# Altium schematic sheet top.SchDoc
size 431 x 279 mm; Author: Pawel Bukowiec; Organization: ORGANIZATION; Address1: ADDRESS 1; Address2: ADDRESS 2; Address3: ADDRESS 3; Address4: ADDRESS 4; Revision: 1; SheetNumber: 2; SheetTotal: 5; ENG_APP_DATE: --/--/--; DSN_APP_DATE: --/--/--; CHK_APP_DATE: --/--/--
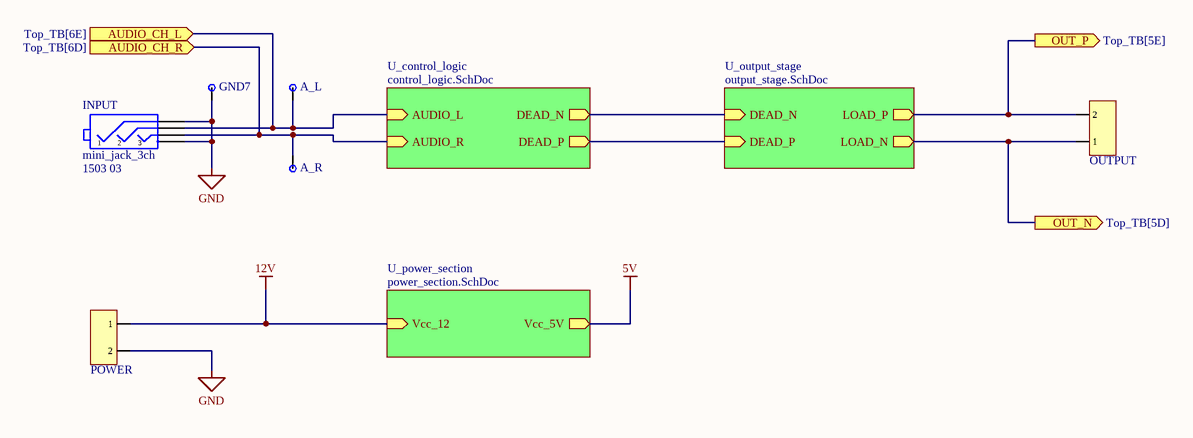
[diagram p0: top.SchDoc]

## Parts
A_L  TestPoint  [TestPoint_SMT]  (value not drawn)
A_R  TestPoint  [TestPoint_SMT]  (value not drawn)
GND7  TestPoint  [TestPoint_SMT]  (value not drawn)
INPUT  mini_jack_3ch  Part number: 1503 03  [150303_mini_jack3.5mm]  (graphical)
OUTPUT  Connector_1x2  [TerminalBlock_1x2]  (value not drawn)  (graphical)
POWER  Connector_1x2  [TerminalBlock_1x2]  (value not drawn)  (graphical)

## Sub-sheets
U_control_logic = control_logic.SchDoc: DEAD_N (out), DEAD_P (out), AUDIO_R (in), AUDIO_L (in)
U_output_stage = output_stage.SchDoc: DEAD_N (in), DEAD_P (in), LOAD_P (out), LOAD_N (out)
U_power_section = power_section.SchDoc: Vcc_12 (in), Vcc_5V (out)

## Ports
AUDIO_CH_L (in, see Top_TB[6E]), AUDIO_CH_R (in, see Top_TB[6D]), OUT_N (out, see Top_TB[5D]), OUT_P (out, see Top_TB[5E])

## Nets
5V: sheet U_power_section/Vcc_5V
12V: POWER.1 ; sheet U_power_section/Vcc_12
GND: GND7.1 INPUT.1 INPUT.4 POWER.2
AUDIO_CH_L: A_L.1 INPUT.2 ; port AUDIO_CH_L, sheet U_control_logic/AUDIO_L
AUDIO_CH_R: A_R.1 INPUT.3 ; port AUDIO_CH_R, sheet U_control_logic/AUDIO_R
OUT_N: OUTPUT.1 ; port OUT_N, sheet U_output_stage/LOAD_N
OUT_P: OUTPUT.2 ; port OUT_P, sheet U_output_stage/LOAD_P
(unnamed): sheet U_control_logic/DEAD_N, sheet U_output_stage/DEAD_N
(unnamed): sheet U_control_logic/DEAD_P, sheet U_output_stage/DEAD_P

## Notes on the sheet
- Project Name:
- Company Confidential / Not for distribution!
- Document Name:
- Designer Name:
- Date/Time:
- Revision:

## Library data of the parts
A_L A_R GND7 = TestPoint: Test Point
INPUT = mini_jack_3ch: Connector: Jack 3.5mm; socket; female; stereo; tracks: 3; Producer: LUMBERG; ComponentLink1Description: TME; ComponentLink1URL: https://www.tme.eu/pl/details/1503-03/zlacza-jack/lumberg/1503-03/
OUTPUT POWER = Connector_1x2: Fixed Terminal Blocks Terminal block, screw type, 1x2; ComponentLink1Description: TME site; ComponentLink1URL: https://www.tme.eu/pl/details/dg126-5.0-2p14/listwy-zaciskowe-do-druku/degson-electronics/dg126-5-0-02p-14-00z-h/